# EasyEDA Pro project ProProject_基于STM32的Buck-Boost型数字电源_2024-06-04.epro, schematic 面板
Create Date: 2024-03-08; Page Name: P1; Project Name: 基于STM32的Buck-Boost型数字电源; Schematic Name: 面板; Update Date: 2024-04-10; Company: blog.zeruns.tech; Page Size: A4; Version: V2.0
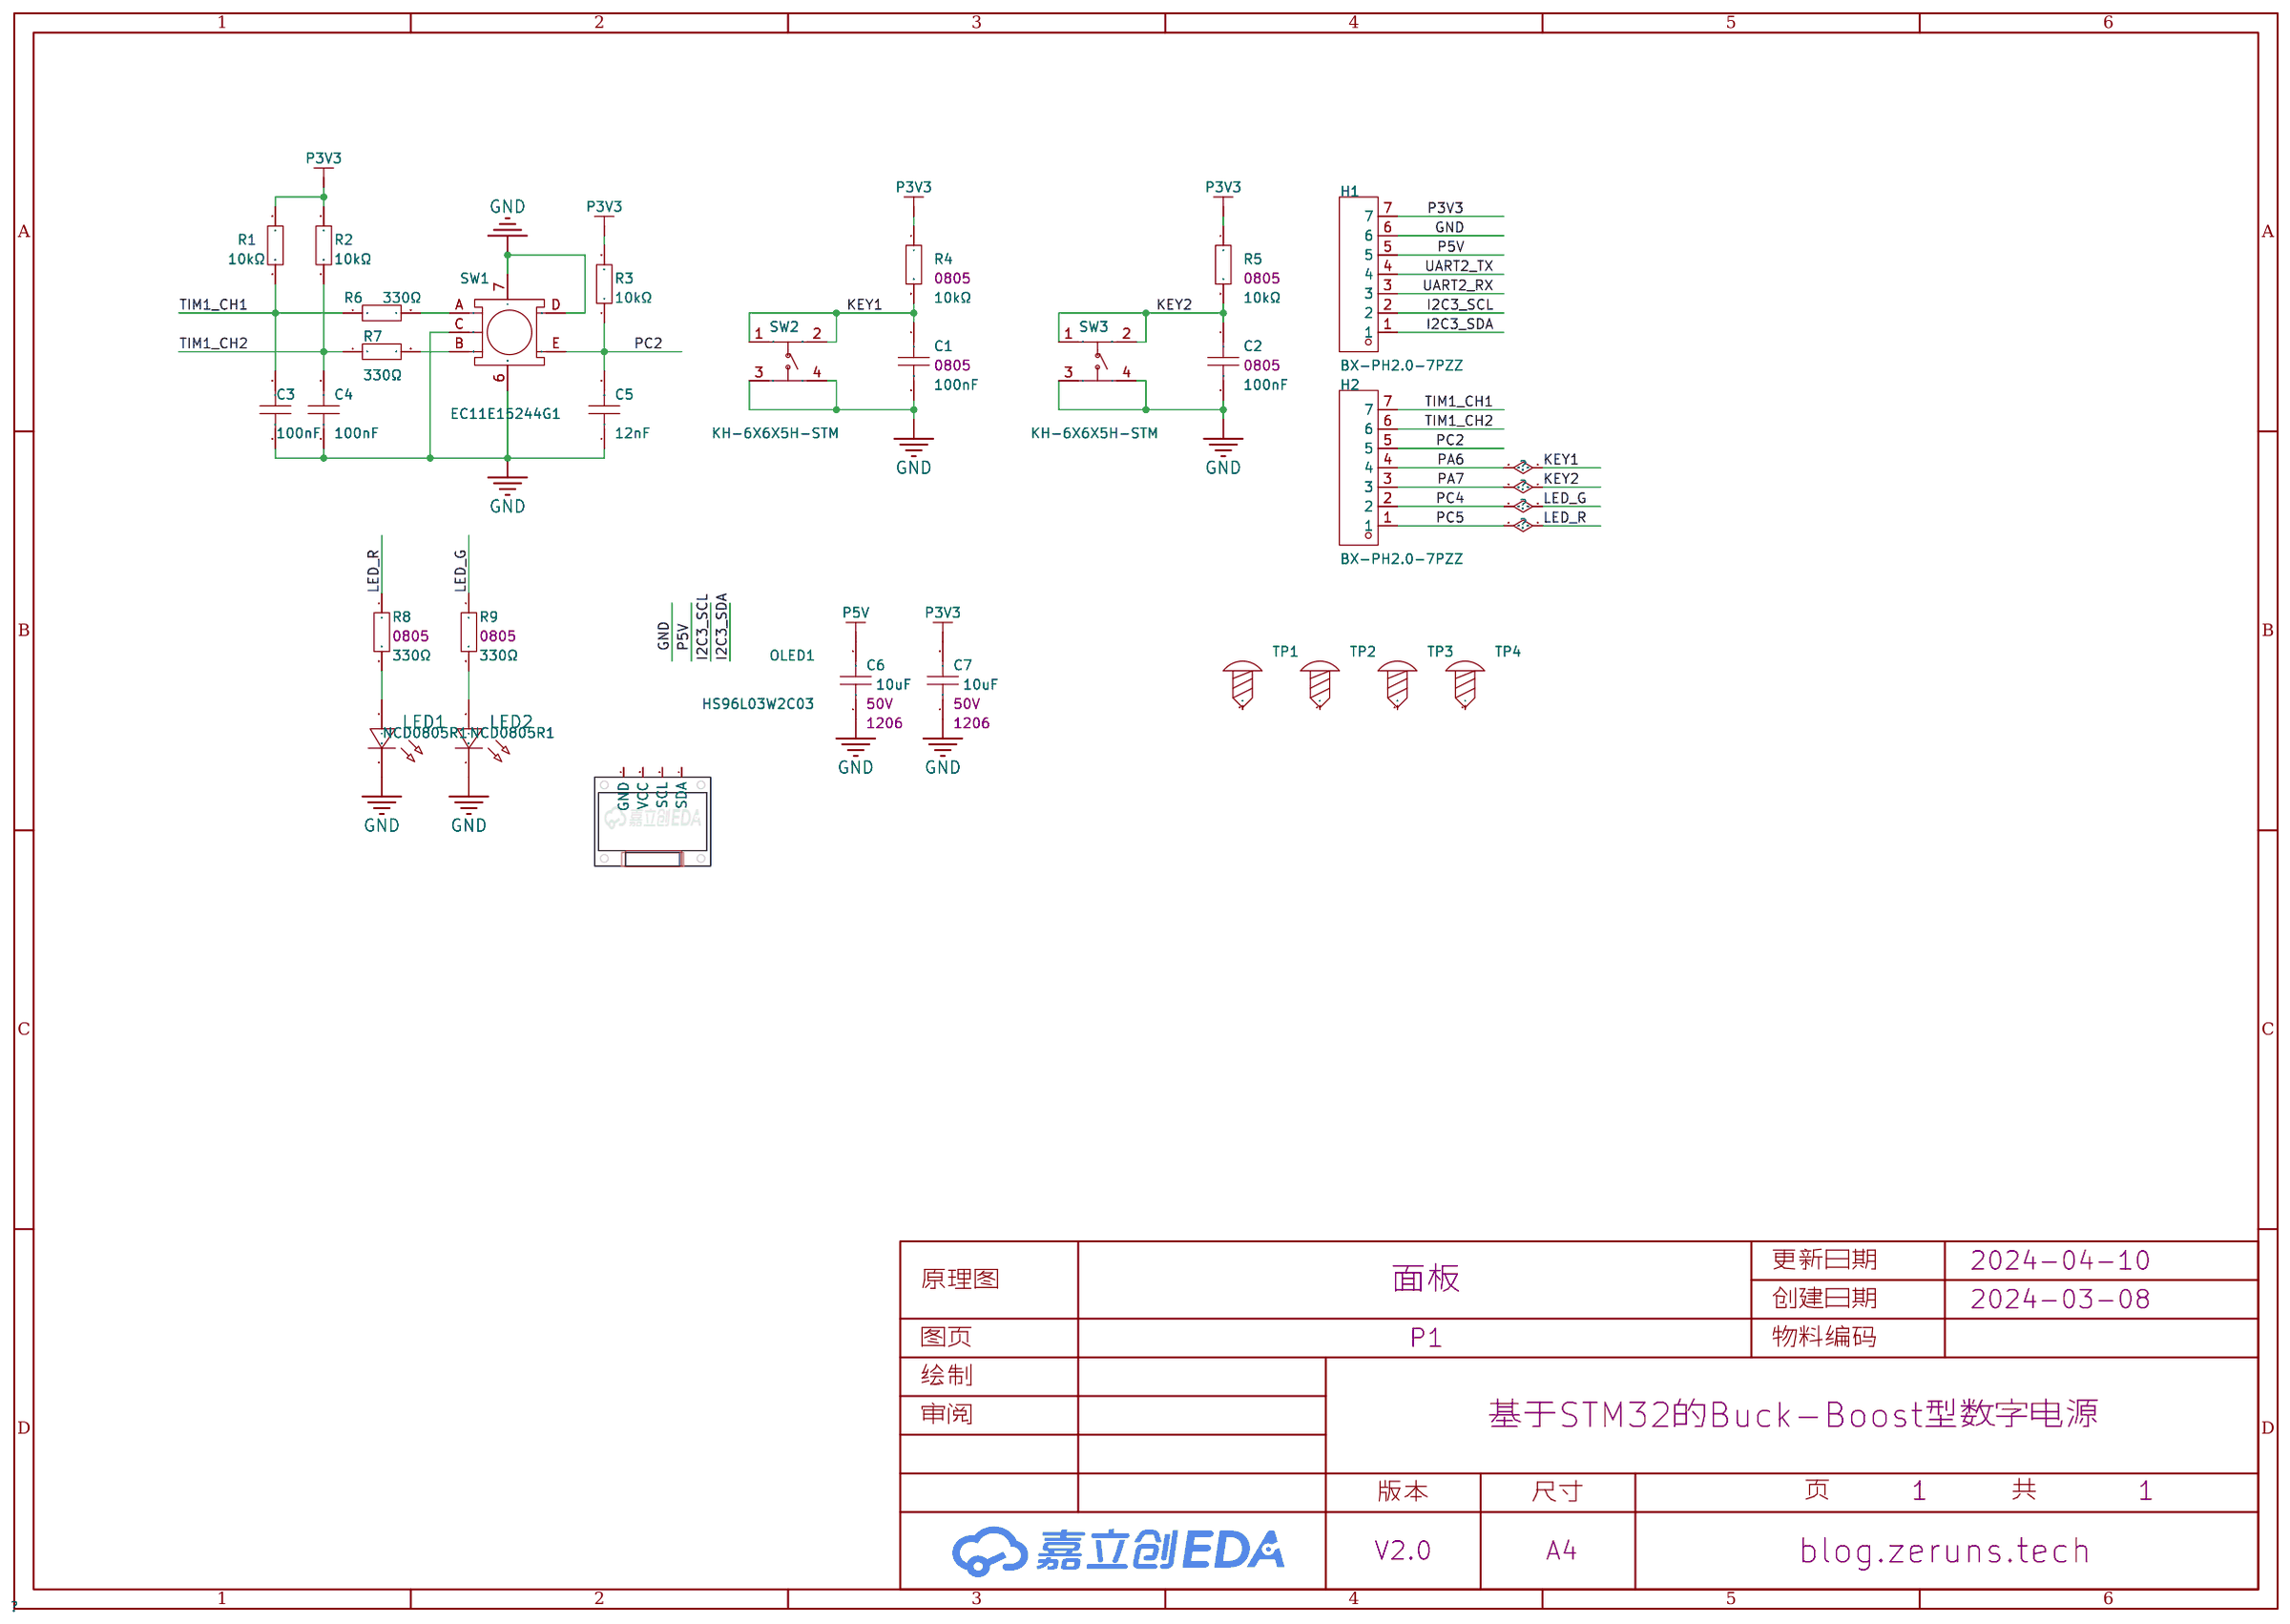
[diagram p4: schematic sheet]

## Parts
C1  100nF  [C0805]
C2  100nF  [C0805]
C3  100nF  [C0805]
C4  100nF  [C0805]
C5  12nF  [C0805]
C6  10uF  [C1206]
C7  10uF  [C1206]
H1  BX-PH2.0-7PZZ  [CONN-TH_7P-P2.00_BX-PH2.0-7PZZ]
H2  BX-PH2.0-7PZZ  [CONN-TH_7P-P2.00_BX-PH2.0-7PZZ]
LED1  NCD0805R1  [LED_0805]
LED2  NCD0805R1  [LED_0805]
OLED1  HS96L03W2C03  [0.96OLED_4P]
R1  10kΩ  [R0805]
R2  10kΩ  [R0805]
R3  10kΩ  [R0805]
R4  10kΩ  [R0805]
R5  10kΩ  [R0805]
R6  330Ω  [R0805]
R7  330Ω  [R0805]
R8  330Ω  [R0805]
R9  330Ω  [R0805]
SW1  EC11E15244G1  [SW-TH_EC11E15244G1]
SW2  KH-6X6X5H-STM  [SW-SMD_4P-L6.0-W6.0-P4.50-LS9.0-2]
SW3  KH-6X6X5H-STM  [SW-SMD_4P-L6.0-W6.0-P4.50-LS9.0-2]
TP1  -  [M3螺丝]
TP2  -  [M3螺丝]
TP3  -  [M3螺丝]
TP4  -  [M3螺丝]

## Library data of the parts
C1 C2 = CL21B474KBFNNNE: 容值:470nF;精度:±10%;额定电压:50V;材质(温度系数):X7R;; LCSC Part Name: 470nF ±10% 50V; Supplier Part: C13967; Manufacturer: SAMSUNG(三星); Supplier Footprint: 0805; JLCPCB Part Class: Basic Part; Datasheet: https://atta.szlcsc.com/upload/public/pdf/source/20160218/1457707763339.pdf; Supplier: LCSC; Tolerance: ±10%; Voltage Rated: 50V; Temperature Coefficient: X7R
C3-C5 = CAP_0805: Supplier Footprint: 0805
C6 C7 = CS3216X5R106K500NRI: 容值:10uF;精度:±10%;额定电压:50V;材质(温度系数):X5R;; LCSC Part Name: 10uF ±10% 50V; Supplier Part: C513774; Manufacturer: SAMWHA(三和); Supplier Footprint: 1206; JLCPCB Part Class: Extended Part; Datasheet: https://atta.szlcsc.com/upload/public/pdf/source/20200519/C513774_8E6AF19D7056FD60653684FA0E0AD594.pdf; Supplier: LCSC; Tolerance: ±10%; Voltage Rated: 50V; Temperature Coefficient: X5R; 额定电压: 50V
H1 H2 = BX-PH2.0-7PZZ: 插针结构:1x7P;间距:2mm;安装方式:直插;参考系列:PH;总PIN数:7P;排数:1;每排PIN数:7;行距:-;额定电流:2A;触头材质:黄铜;触头镀层:锡;工作温度范围:-25℃~+85℃;; Supplier Part: C18077749; Manufacturer: Bossie(博锡); Supplier Footprint: 插件,P=2mm; JLCPCB Part Class: 扩展库; Datasheet: https://atta.szlcsc.com/upload/public/pdf/source/20231017/AFA858640E38828F799B06911EC337E6.pdf; Supplier: LCSC; Pins Structure: 1x7P; Pitch: 2mm; Mounting Style: 直插; Reference Series: PH; Number of Pins: 7P; Number of Rows: 1; Number of PINs Per Row: 7; Current Rating (Max): 2A; Contact Material: 黄铜; Contact Plating: 锡; Operating Temperature Range: -25℃~+85℃
LED1 LED2 = NCD0805R1: 灯头类型:-;发光颜色:红色;正向电压(VF):1.6V~2.6V;功率:65mW;正向电流:20mA;主波长:615nm~630nm;二极管配置:独立二极管;透镜颜色:无色透明;色温:-;发光强度:67mcd~195mcd;发光角度:130°;载带方式:-;工作温度:-30℃~+85℃;; Supplier Part: C84256; Manufacturer: 国星光电; Supplier Footprint: 0805; JLCPCB Part Class: Basic Part; Datasheet: https://atta.szlcsc.com/upload/public/pdf/source/20200820/C84256_F0A75A43B3EAD75808600A0514C76B99.pdf; Supplier: LCSC; Emitted Color: 红色; Forward Voltage (VF): 1.6V~2.6V; Power Dissipation: 65mW; Forward Current: 20mA; Dominant Wavelength: 615nm~630nm; Diode Configuration: 独立二极管; Lens Color: 无色透明; Luminous Intensity: 67mcd~195mcd; Viewing Angle: 130°; Operating Temperature: -30℃~+85℃
OLED1 = HS96L03W2C03: 主控芯片:SSD1315;接口类型:I2C;尺寸(inch):0.96;像素分辨率:128x64;; LCSC Part Name: 0.96寸OLED显示屏窄白光IIC; Supplier Part: C5248080; Manufacturer: HS(汉昇); JLCPCB Part Class: Extended Part; Datasheet: https://atta.szlcsc.com/upload/public/pdf/source/20230627/763D01F79A90007632F098068C7C8AD9.pdf; Supplier: LCSC; Main Control Chip: SSD1315; Interface Type: I2C; Size: 0.96; Pixel Resolution: 128x64; Operating Temperature: -40℃~+70℃
R1-R3 = 0805W8F1002T5E_C17414: 电阻类型:厚膜电阻;阻值:10kΩ;精度:±1%;功率:125mW;; LCSC Part Name: 10kΩ ±1% 125mW; Supplier Part: C17414; Manufacturer: UNI-ROYAL(厚声); Manufacturer Part: 0805W8F1002T5E; Supplier Footprint: 0805; JLCPCB Part Class: Basic Part; Datasheet: https://atta.szlcsc.com/upload/public/pdf/source/20200306/C422600_1E6D84923E4A46A82E41ADD87F860B5C.pdf; Supplier: LCSC; Tolerance: ±1%; Power(Watts): 125mW; Overload Voltage (Max): 150V; Temperature Coefficient: ±100ppm/℃; Type: 厚膜电阻; Operating Temperature Range: -55℃~+155℃
R4 R5 = 0805W8F1002T5E_C17414: 阻值:10kΩ;精度:±1%;功率:125mW;温度系数:±100ppm/℃;电阻类型:厚膜电阻;; LCSC Part Name: 10kΩ ±1% 125mW 厚膜电阻; Supplier Part: C17414; Manufacturer: UNI-ROYAL(厚声); Manufacturer Part: 0805W8F1002T5E; Supplier Footprint: 0805; JLCPCB Part Class: Basic Part; Datasheet: https://atta.szlcsc.com/upload/public/pdf/source/20200306/C422600_1E6D84923E4A46A82E41ADD87F860B5C.pdf; Supplier: LCSC; Tolerance: ±1%; Power(Watts): 125mW; Overload Voltage (Max): 150V; Temperature Coefficient: ±100ppm/℃; Type: 厚膜电阻; Operating Temperature Range: -55℃~+155℃
R6 R7 = Res_0805: Supplier Footprint: 0805
R8 R9 = 0805W8F3001T5E: 阻值:3kΩ;精度:±1%;功率:125mW;温度系数:±100ppm/℃;电阻类型:厚膜电阻;; LCSC Part Name: 3kΩ ±1% 125mW 厚膜电阻; Supplier Part: C17661; Manufacturer: UNI-ROYAL(厚声); Supplier Footprint: 0805; JLCPCB Part Class: Basic Part; Datasheet: https://atta.szlcsc.com/upload/public/pdf/source/20200306/C422600_1E6D84923E4A46A82E41ADD87F860B5C.pdf; Supplier: LCSC; Tolerance: ±1%; Power(Watts): 125mW; Overload Voltage (Max): 150V; Temperature Coefficient: ±100ppm/℃; Type: 厚膜电阻; Operating Temperature Range: -55℃~+155℃
SW1 = EC11E15244G1: LCSC Part Name: 编码器; Supplier Part: C370970; Manufacturer: ALPSALPINE(阿尔卑斯阿尔派); Supplier Footprint: 插件; JLCPCB Part Class: 扩展库; Datasheet: https://atta.szlcsc.com/upload/public/pdf/source/20190222/C370970_45D3DFC793E5CF6FACAF06DB9E7FAE9E.pdf; Supplier: LCSC
SW2 SW3 = KH-6X6X5H-STM: 电路结构:单刀单掷;带支架:否;触点电流:50mA;额定电压(DC):12V;安装方式:立贴;机械寿命:8万次;; LCSC Part Name: 6*6*5mm 立贴 轻触开关; Supplier Part: C2837531; Manufacturer: kinghelm(金航标); Supplier Footprint: SMD; JLCPCB Part Class: 扩展库; Datasheet: https://atta.szlcsc.com/upload/public/pdf/source/20210608/C2837531_45E87AB996CE723B09405FF2EA209C4C.pdf; Supplier: LCSC; Circuit: 单刀单掷; Actuator Style: 圆形按钮; Switch Length: 6mm; Switch Width: 6mm; Switch Height: 5mm; Strike Gundam: 否; Contact Current: 50mA; Voltage Rating (DC): 12V; Mounting Style: 立贴; Actuator/Cap Color: 黑色; Pin Style: 鸥翼型; Mechanical Life: 8万次
TP1-TP4 = M3螺丝: Supplier Footprint: 插件

## Nets
GND: C1.2 C2.2 C3.1 C4.1 C5.1 C6.1 C7.1 H1.6 LED1.1(C) LED2.1(C) SW1.6 SW1.7 SW1.C SW1.D SW2.3 SW2.4 SW3.3 SW3.4
P3V3: C7.2 H1.7 R1.2 R2.2 R3.2 R4.1 R5.1
P5V: C6.2 H1.5
I2C3_SCL: H1.2
I2C3_SDA: H1.1
KEY1: C1.1 H2.4 R4.2 SW2.1 SW2.2
KEY2: C2.1 H2.3 R5.2 SW3.1 SW3.2
LED_G: H2.2 R9.1
LED_R: H2.1 R8.1
PC2: C5.2 H2.5 R3.1 SW1.E
TIM1_CH1: C3.2 H2.7 R1.1 R6.1
TIM1_CH2: C4.2 H2.6 R2.1 R7.1
UART2_RX: H1.3
UART2_TX: H1.4
$1N356: R6.2 SW1.A
$1N357: R7.2 SW1.B
$1N559: LED1.2(A) R8.2
$1N563: LED2.2(A) R9.2

Not connected (* = marked no-connect by the designer): OLED1 1(GND) 2(VCC) 3(SCL) 4(SDA); TP1 1; TP2 1; TP3 1; TP4 1
